# EAGLE design RamaTAV1 (EAGLE 9.6.2)
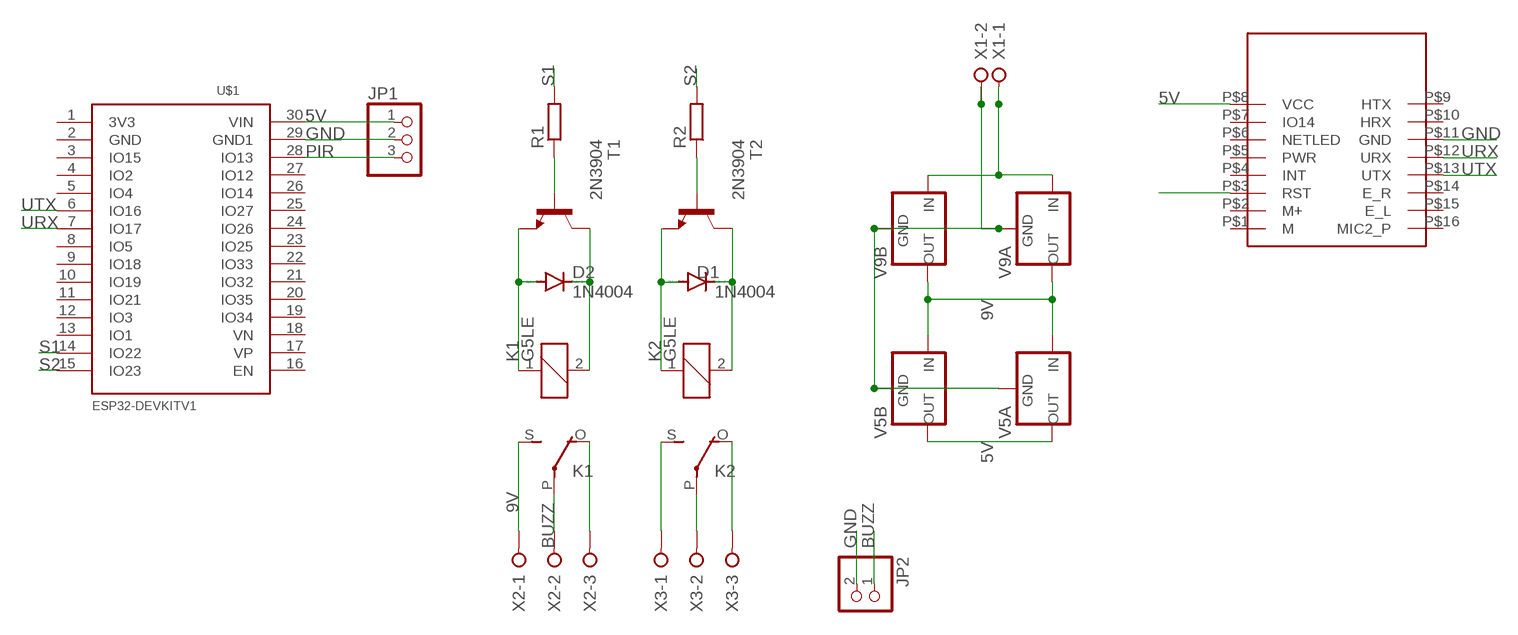
[diagram p0: schematic, sheet 1]

## Parts
D1  1N4004  [DO41-10]
D2  1N4004  [DO41-10]
JP1  PINHD-1X3  [1X03]
JP2  PINHD-1X2  [1X02]
K1  G5LE  [G5LE]
K2  G5LE  [G5LE]
R1  R-EU_0207/10  [0207/10]
R2  R-EU_0207/10  [0207/10]
T1  2N3904  [TO92]
T2  2N3904  [TO92]
U$1  ESP32DEVKITV1  [ESP32-DEVKITV1]
U$7  SIM_A6SIM_GA6  [SIM_GA6]
V5A  78XXS  [78XXS]
V5B  78XXS  [78XXS]
V9A  78XXS  [78XXS]
V9B  78XXS  [78XXS]
X1  W237-02P  [W237-2]
X2  W237-03P  [W237-3]
X3  W237-03P  [W237-3]

## Nets
5V: JP1.1 U$1.30(VIN) U$7.P$8(VCC) V5A.OUT V5B.OUT
9V: K1.S(2:S) V5A.IN V5B.IN V9A.OUT V9B.OUT X2.1
BUZZ: JP2.1 K1.P(2:P) X2.2
GND: JP1.2 JP2.2 U$1.29(GND1) U$7.P$11(GND)
N$2: U$7.P$3(RST)
N$3: K1.O(2:O) X2.3
N$4: K2.P(2:P) X3.2
N$5: K2.O(2:O) X3.3
N$6: K2.S(2:S) X3.1
N$10: V5A.GND V5B.GND V9A.GND V9B.GND X1.2
N$11: R1.1 T1.2(B)
N$12: V9A.IN V9B.IN X1.1
N$13: R2.1 T2.2(B)
N$15: D2.A K1.1 T1.3(E)
N$16: D2.C K1.2 T1.1(C)
N$17: D1.A K2.1 T2.3(E)
N$18: D1.C K2.2 T2.1(C)
PIR: JP1.3 U$1.28(IO13)
S1: R1.2 U$1.14(IO22)
S2: R2.2 U$1.15(IO23)
URX: U$1.7(IO17) U$7.P$12(URX)
UTX: U$1.6(IO16) U$7.P$13(UTX)
Unconnected: U$1.1(3V3) U$1.2(GND) U$1.3(IO15) U$1.4(IO2) U$1.5(IO4) U$1.8(IO5) U$1.9(IO18) U$1.10(IO19) U$1.11(IO21) U$1.12(IO3) U$1.13(IO1) U$1.16(EN) U$1.17(VP) U$1.18(VN) U$1.19(IO34) U$1.20(IO35) U$1.21(IO32) U$1.22(IO33) U$1.23(IO25) U$1.24(IO26) U$1.25(IO27) U$1.26(IO14) U$1.27(IO12) U$7.P$1(M) U$7.P$2(M+) U$7.P$4(INT) U$7.P$5(PWR) U$7.P$6(NETLED) U$7.P$7(IO14) U$7.P$9(HTX) U$7.P$10(HRX) U$7.P$14(E_R) U$7.P$15(E_L) U$7.P$16(MIC2_P)

## Library data of the parts
D1 D2 = diode:1N4004: DIODE general purpose rectifier, 1 A
JP1 = pinhead:PINHD-1X3: PIN HEADER
JP2 = pinhead:PINHD-1X2: PIN HEADER
K1 K2 = G5LE_1:G5LE: RELAY 1 x switch, 10 A/120 V AC, 8 A/30 V DC, Omron
R1 R2 = rcl:R-EU_: RESISTOR, European symbol; SPICEPREFIX: R
T1 T2 = transistor:2N3904: NPN TRANSISTOR
U$1 = ESP32-DEVKITV1:ESP32DEVKITV1
U$7 = SIM_A6:SIM_A6: SIM GA6
V5A V5B V9A V9B = v-reg:78XXS: VOLTAGE REGULATOR
X1 = Terminal_Block_5mm.:W237-02P: WAGO SREW CLAMP; OC_FARNELL: unknown; OC_NEWARK: unknown
X2 X3 = Terminal_Block_5mm.:W237-03P: WAGO SREW CLAMP; OC_FARNELL: unknown; OC_NEWARK: unknown

## Board
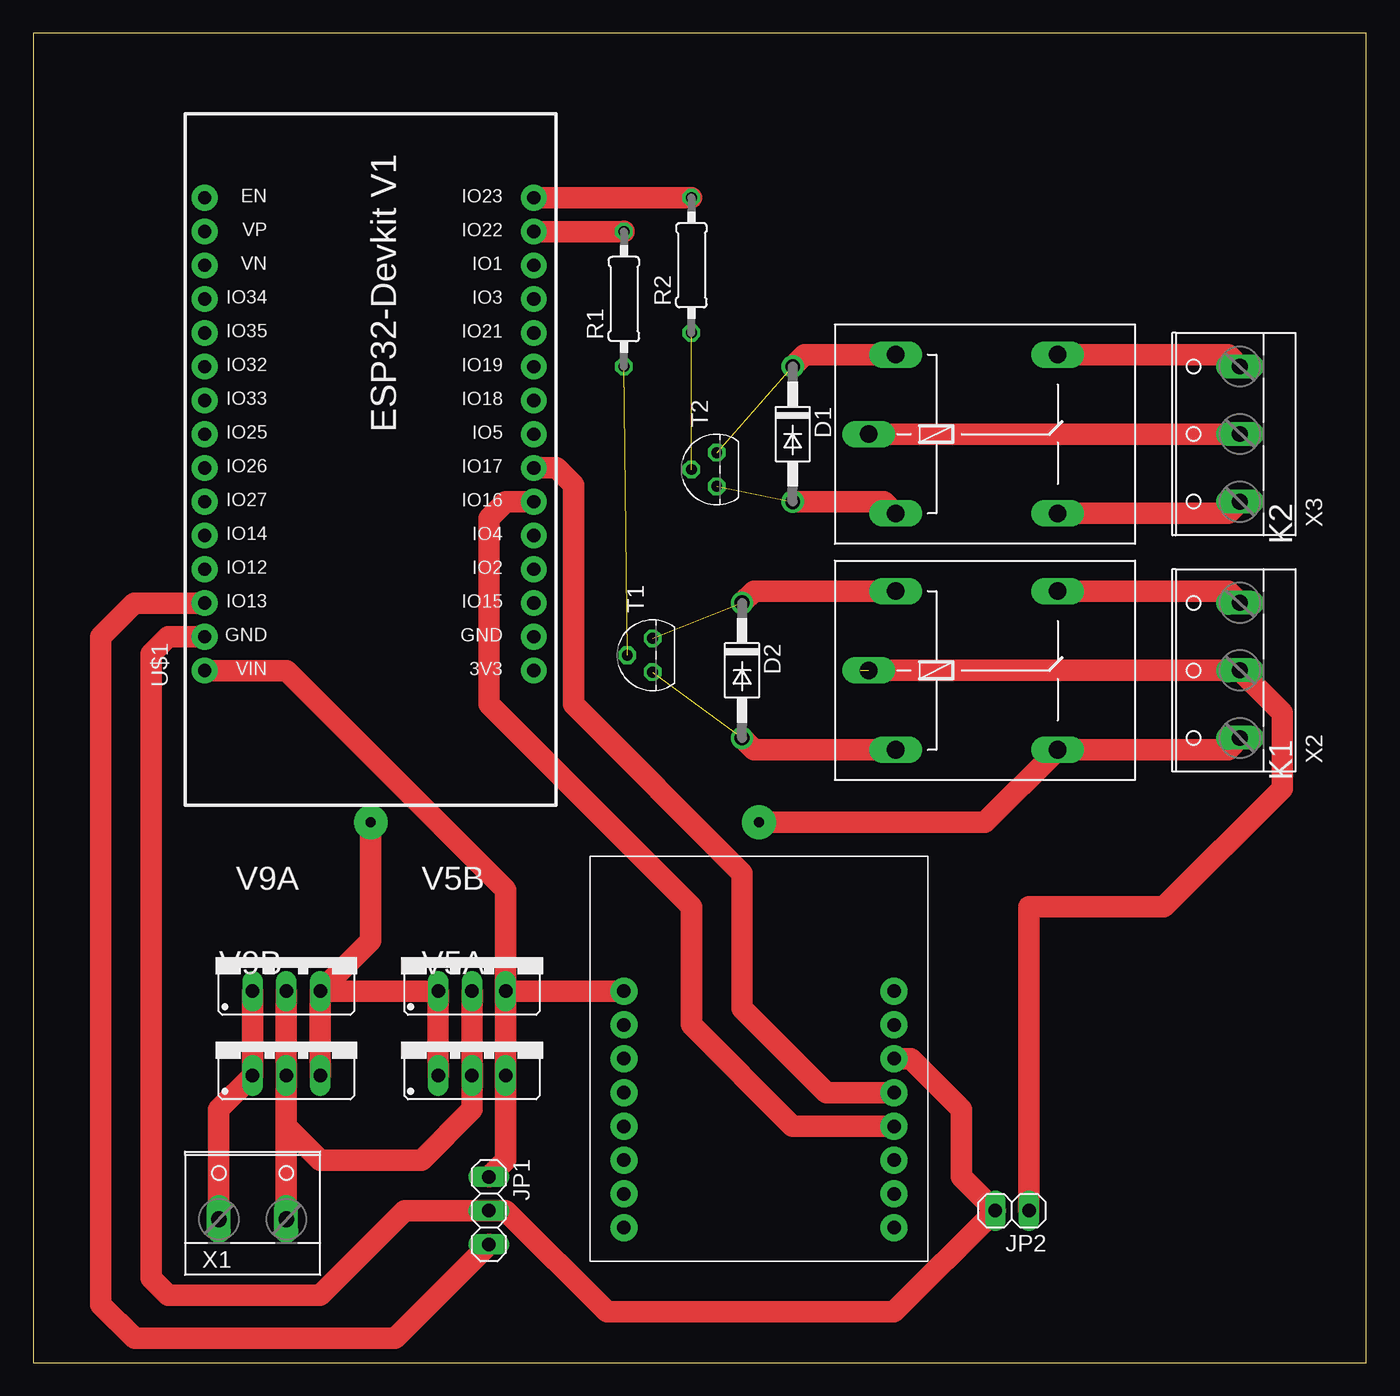
[diagram p1: board, top side]
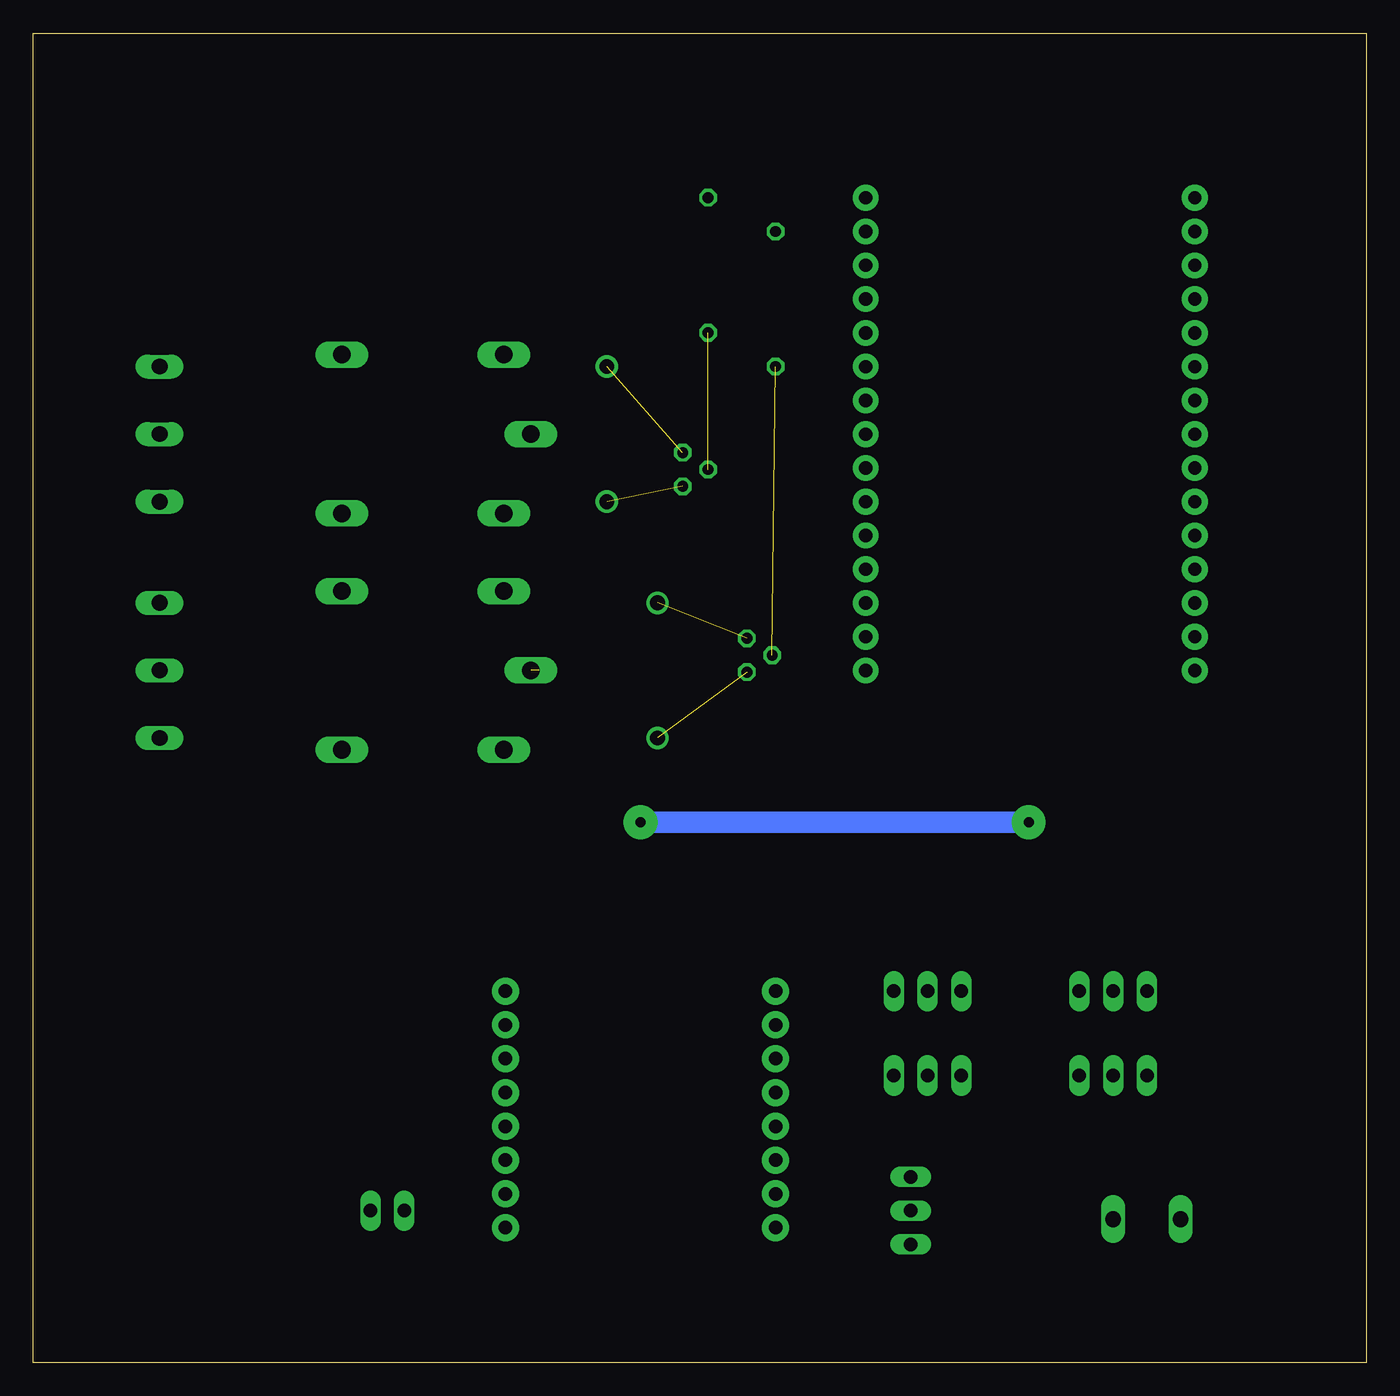
[diagram p2: board, bottom side, seen from below]

Size 100.31 x 100 mm. Coordinates in mm from the lower left corner, seen from the top.
Outline: 0,0 100.31,0 100.31,100 0,100 0,0
Copper layers (1*16): Top 0.035mm / dielectric 1.5mm / Bottom 0.035mm
Design rules "default": minimum track width 6mil, minimum drill 0.35mm, track to track 6mil, track to pad 6mil, pad to pad 6mil, via to via 6mil, smd to smd 6mil, copper to edge 40mil, drill to drill 6mil, minimum pad ring 10mil, minimum via ring 8mil, stop-mask expansion 4mil, vias tented up to drill 0mil, thermal gap 10mil

### Footprints (pad centres in the part's own frame; a part is rotated, then mirrored left to right if it is on the bottom)
DO41-10 = drill 1.118: A 5.08,0; C -5.08,0
1X03 = drill 1.016 long: 1 -2.54,0; 2 0,0; 3 2.54,0
1X02 = drill 1.016 long: 1 -1.27,0; 2 1.27,0
G5LE = drill 1.321 long: 1 -7.493,-5.969; 2 -7.493,5.969; O 4.699,5.969; P -9.525,0; S 4.699,-5.969
0207/10 = drill 0.813 octagon: 1 -5.08,0; 2 5.08,0
TO92 = drill 0.813 octagon: 1 1.27,0; 2 0,1.905; 3 -1.27,0
ESP32-DEVKITV1 = drill 1 pad 1.93: 1 -22.87,-13.54; 2 -20.33,-13.54; 3 -17.79,-13.54; 4 -15.25,-13.54; 5 -12.71,-13.54; 6 -10.17,-13.54; 7 -7.63,-13.54; 8 -5.09,-13.54; 9 -2.55,-13.54; 10 -0.01,-13.54; 11 2.53,-13.54; 12 5.07,-13.54; 13 7.61,-13.54; 14 10.15,-13.54; 15 12.69,-13.54; 16 12.69,11.23; 17 10.15,11.23; 18 7.61,11.23; 19 5.07,11.23; 20 2.53,11.23; 21 -0.01,11.23; 22 -2.55,11.23; 23 -5.09,11.23; 24 -7.63,11.23; 25 -10.17,11.23; 26 -12.71,11.23; 27 -15.25,11.23; 28 -17.79,11.23; 29 -20.33,11.23; 30 -22.87,11.23
SIM_GA6 = drill 1.016 pad 2.032: P$1 -10.16,-8.89; P$2 -10.16,-6.35; P$3 -10.16,-3.81; P$4 -10.16,-1.27; P$5 -10.16,1.27; P$6 -10.16,3.81; P$7 -10.16,6.35; P$8 -10.16,8.89; P$9 10.16,8.89; P$10 10.16,6.35; P$11 10.16,3.81; P$12 10.16,1.27; P$13 10.16,-1.27; P$14 10.16,-3.81; P$15 10.16,-6.35; P$16 10.16,-8.89
78XXS = drill 1.016 long: GND 0,-2.54; IN -2.54,-2.54; OUT 2.54,-2.54
W237-2 = drill 1.194 long: 1 -2.54,-0.635; 2 2.54,-0.635
W237-3 = drill 1.194 long: 1 -5.08,-0.635; 2 0,-0.635; 3 5.08,-0.635

### Placement (x,y rotation side)
D1  57.15,69.85 270 top
D2  53.34,52.07 270 top
JP1  34.29,11.43 270 top
JP2  73.66,11.43 180 top
K1  72.39,52.07 0 top
K2  72.39,69.85 0 top
R1  44.45,80.01 90 top
R2  49.53,82.55 90 top
T1  46.61,53.21 90 top
T2  51.44,67.18 90 top
U$1  24.13,74.93 90 top
U$7  54.61,19.05 0 top
V5A  33.02,24.13 0 top
V5B  33.02,30.48 0 top
V9A  19.05,30.48 0 top
V9B  19.05,24.13 0 top
X1  16.51,11.43 0 top
X2  90.17,52.07 90 top
X3  90.17,69.85 90 top

### Tracks (layer width: path | path; a pad name or v marks a point on that pad's centre or on a via)
5V
  Top 1.626: V5A.OUT V5B.OUT | 35.56,20.32 V5A.OUT | JP1.1 35.56,15.24 V5A.OUT | V5B.OUT U$7.P$8 | V5B.OUT 35.56,35.56 19.06,52.06 U$1.30
9V  (via drill 0.75 pad 2.54)
  Top 1.626: V9B.OUT V9A.OUT | V9A.OUT V5B.IN V5A.IN | X2.1 89.92,46.1 K1.S 71.63,40.64 v54.61,40.64 | v25.4,40.64 25.4,31.75 V9A.OUT
  Bottom 1.626: v54.61,40.64 v25.4,40.64
BUZZ  (1 unrouted)
  Top 1.626: JP2.1 74.93,34.29 85.09,34.29 93.98,43.18 93.98,48.9 X2.2 62.23,52.07
GND
  Top 1.626: U$1.29 10.15,54.6 8.89,53.34 8.89,6.35 10.16,5.08 21.59,5.08 27.94,11.43 JP1.2 35.56,11.43 43.18,3.81 64.77,3.81 JP2.2 69.85,13.97 69.85,19.05 66.04,22.86 U$7.P$11
N$3
  Top 1.626: K1.O 89.92,58.04 X2.3
N$4
  Top 1.626: K2.P X3.2
N$5
  Top 1.626: K2.O 89.92,75.82 X3.3
N$6
  Top 1.626: K2.S 89.92,63.88 X3.1
N$10
  Top 1.626: 19.05,17.78 V9B.GND V9A.GND | 19.05,17.78 X1.2 | V5B.GND V5A.GND 33.02,19.05 29.21,15.24 21.59,15.24 19.05,17.78
N$11  (1 unrouted)
N$12
  Top 1.626: X1.1 13.97,19.05 V9B.IN V9A.IN
N$13  (1 unrouted)
N$15  (1 unrouted)
  Top 1.626: D2.A 54.23,46.1 K1.1
N$16  (1 unrouted)
  Top 1.626: D2.C 54.23,58.04 K1.2
N$17  (1 unrouted)
  Top 1.626: D1.A 64.01,64.77 K2.1
N$18  (1 unrouted)
  Top 1.626: D1.C 58.04,75.82 K2.2
PIR
  Top 1.626: U$1.28 7.61,57.14 5.08,54.61 5.08,4.37 7.62,1.83 27.23,1.83 JP1.3
S1
  Top 1.626: R1.2 U$1.14
S2
  Top 1.626: R2.2 U$1.15
URX
  Top 1.626: U$1.7 39.38,67.3 40.64,66.04 40.64,49.53 53.34,36.83 53.34,26.67 59.69,20.32 U$7.P$12
UTX
  Top 1.626: U$7.P$13 57.15,17.78 49.53,25.4 49.53,34.29 34.29,49.53 34.29,63.5 35.56,64.77 U$1.6